# Altium schematic sheet Motor_d.SchDoc
size A4
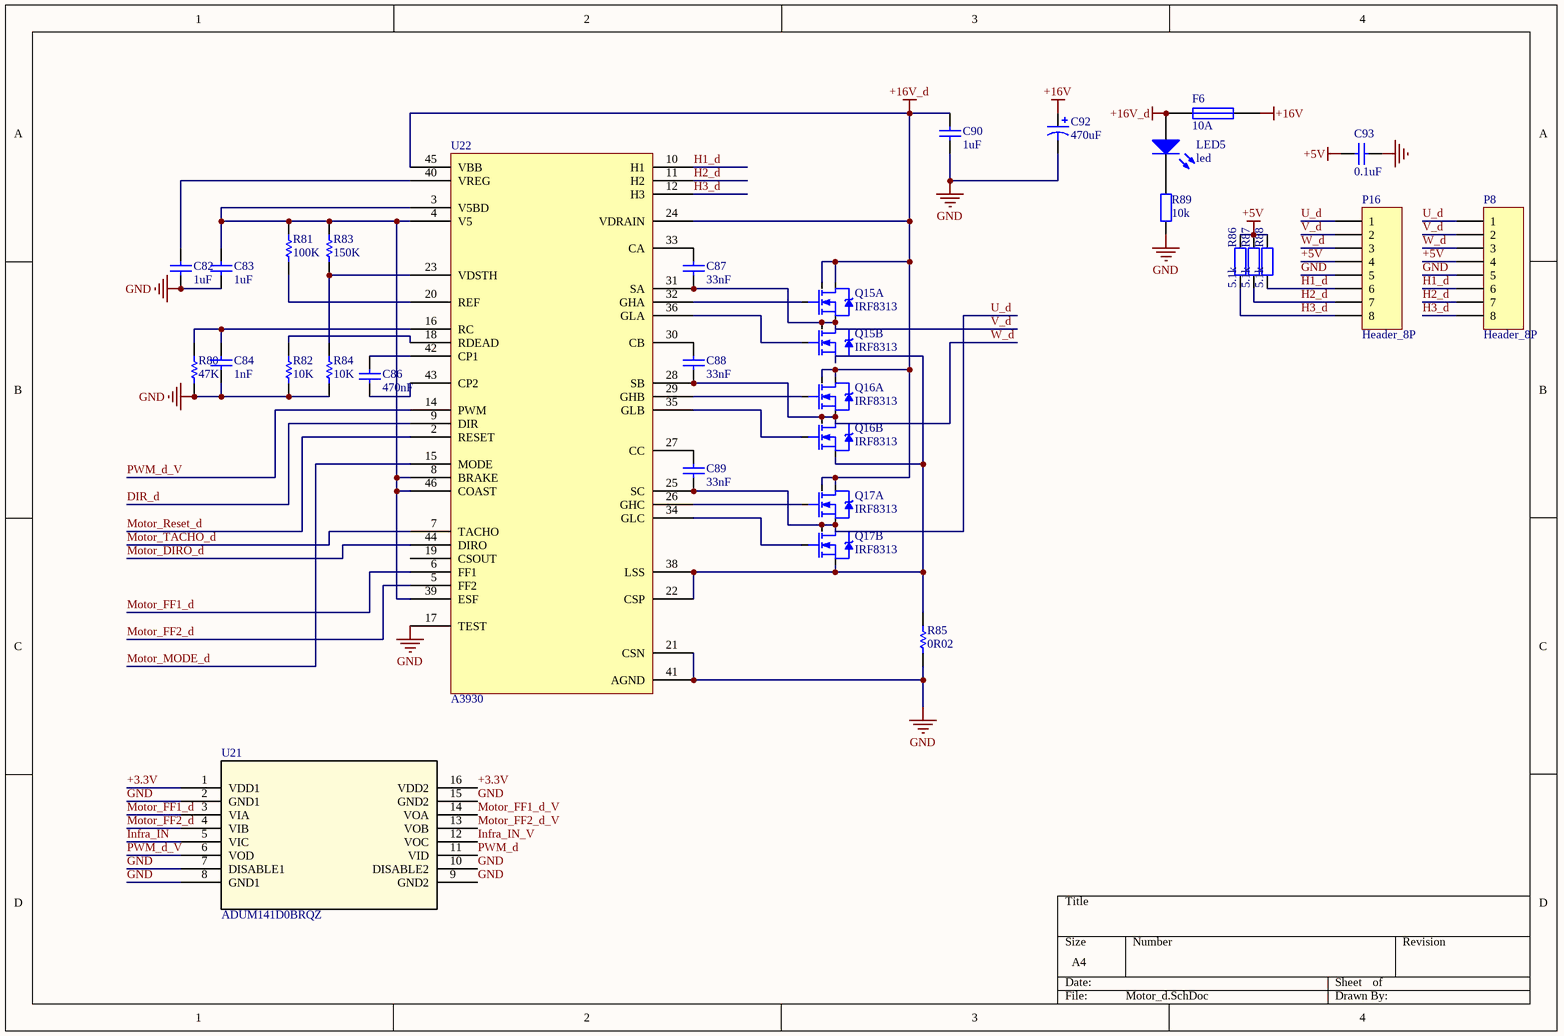
[diagram p0: Motor_d.SchDoc]

## Parts
C82  1uf  [0603C]
C83  1uf  [0603C]
C84  1nf  [0603C]
C86  470nf  [0603C]
C87  33nf  [0603C]
C88  33nf  [0603C]
C89  33nf  [0603C]
C90  1uf  [0603C]
C92  470uF  [470uF]
C93  0.1uf  [0603C]
F6  10A  [FUSE_HEADER]
LED5  led  [0603_diode]
P8  Header_8P  [8P - WF25122]
P16  Header_8P  [SHDR8]
Q15  IRF8313  [so-8 bg]  (parts A,B of 2)
Q16  IRF8313  [so-8 bg]  (parts A,B of 2)
Q17  IRF8313  [so-8 bg]  (parts A,B of 2)
R80  47k  [0603R]
R81  100k  [0603R]
R82  10k  [0603R]
R83  value 150K  [0603R]  (hidden comment: 100k)
R84  10k  [0603R]
R85  value 0R02  [1206 10A]  (hidden comment: 0.02)
R86  5.1k  [0805]
R87  5.1k  [0805]
R88  5.1k  [0805]
R89  10k  [0603]
U21  ADUM141D0BRQZ  [RQ_16]
U22  A3930  [LQFP-48]

## Nets
+5V: C93.2 P8.4 P16.4 R86.1 R87.1 R88.1
+16V: C92.1 F6.1
+16V_d: C90.2 F6.2 LED5.1(A) Q15.7(D2) Q15.8(D2) Q16.7(D2) Q16.8(D2) Q17.7(D2) Q17.8(D2) U22.24(VDRAIN) U22.45(VBB)
GND: C82.1 C83.1 C84.1 C90.1 C92.2 C93.1 P8.5 P16.5 R80.1 R82.1 R84.1 R85.1 R89.1 U21.2(GND1) U21.7(DISABLE1) U21.8(GND1) U21.9(GND2) U21.10(DISABLE2) U21.15(GND2) U22.17(TEST) U22.21(CSN) U22.41(AGND)
+3.3V: U21.1(VDD1) U21.16(VDD2)
DIR_d: U22.9(DIR)
H1_d: P8.6 P16.6 R88.2 U22.10(H1)
H2_d: P8.7 P16.7 R87.2 U22.11(H2)
H3_d: P8.8 P16.8 R86.2 U22.12(H3)
Infra_IN: U21.5(VIC)
Infra_IN_V: U21.12(VOC)
Motor_DIRO_d: U22.44(DIRO)
Motor_FF1_d: U21.3(VIA) U22.6(FF1)
Motor_FF1_d_V: U21.14(VOA)
Motor_FF2_d: U21.4(VIB) U22.5(FF2)
Motor_FF2_d_V: U21.13(VOB)
Motor_MODE_d: U22.15(MODE)
Motor_Reset_d: U22.2(RESET)
Motor_TACHO_d: U22.7(TACHO)
PWM_d: U21.11(VID)
PWM_d_V: U21.6(VOD) U22.14(PWM)
U_d: C89.1 P8.1 P16.1 Q17.1(S2) Q17.5(D1) Q17.6(D1) U22.25(SC)
V_d: C87.1 P8.2 P16.2 Q15.1(S2) Q15.5(D1) Q15.6(D1) U22.31(SA)
W_d: C88.1 P8.3 P16.3 Q16.1(S2) Q16.5(D1) Q16.6(D1) U22.28(SB)
NetC82_2: C82.2 U22.40(VREG)
NetC83_2: C83.2 R81.2 R83.2 U22.3(V5BD) U22.4(V5) U22.8(BRAKE) U22.39(ESF) U22.46(COAST)
NetC84_2: C84.2 R80.2 U22.16(RC)
NetC86_1: C86.1 U22.43(CP2)
NetC86_2: C86.2 U22.42(CP1)
NetC87_2: C87.2 U22.33(CA)
NetC88_2: C88.2 U22.30(CB)
NetC89_2: C89.2 U22.27(CC)
NetLED5_2: LED5.2(K) R89.2
NetQ15_2: Q15.2(G2) U22.32(GHA)
NetQ15_3: Q15.3(S1) Q16.3(S1) Q17.3(S1) R85.2 U22.22(CSP) U22.38(LSS)
NetQ15_4: Q15.4(G1) U22.36(GLA)
NetQ16_2: Q16.2(G2) U22.29(GHB)
NetQ16_4: Q16.4(G1) U22.35(GLB)
NetQ17_2: Q17.2(G2) U22.26(GHC)
NetQ17_4: Q17.4(G1) U22.34(GLC)
NetR81_1: R81.1 U22.20(REF)
NetR82_2: R82.2 U22.18(RDEAD)
NetR83_1: R83.1 R84.2 U22.23(VDSTH)

Not connected (* = marked no-connect by the designer): U22 19(CSOUT)

## Library data of the parts
C82-C84 C86-C90 C93 = Cap: Capacitor; Manufacturer: Generic Components; Class: Passive; Published: 08/06/2000; Publisher: Altium Hobart Technology Centre; SubClass: Capacitor
  C82 C83 C90: Value: 1uF
  C84: Value: 1nF
  C86: Value: 470nF
  C87-C89: Value: 33nF
  C93: Value: 0.1uF
C92 = Cap Pol1: Polarized Capacitor (Radial); Published: 8-Jun-2000; LatestRevisionDate: 17-Jul-2002; LatestRevisionNote: Re-released for DXP Platform.; PackageReference: RB7.6-15; Publisher: Altium Limited; PackageDescription: Polarized Capacitor (Radial); 2 Leads
F6 = FUSE
P8 P16 = Header_8P: Used for Motor connection in ZJUNlict
Q15-Q17 = SO-8 IRF8313
R80-R85 = Res1: Resistor; Manufacturer: Generic Components; Class: Passive; Published: 08/06/2000; Publisher: Altium Hobart Technology Centre; SubClass: Resistor
  R80: Value: 47K
  R81: Value: 100K
  R82 R84: Value: 10K
R86-R89 = res
U21 = ADUM141D0BRQZ: Imported; RefDes: RefDes; Type: DEV; Value: Value
U22 = LQFP 48